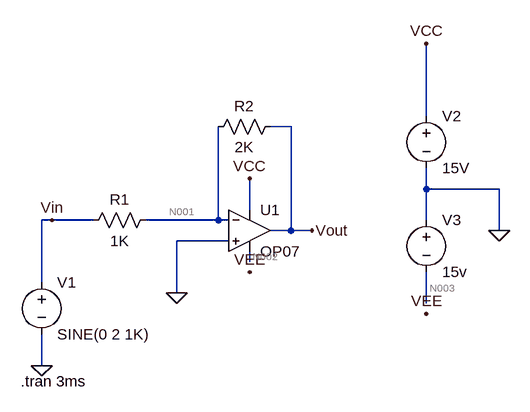
[diagram p0: schematic Draft5.asc]
Draft5.asc, the LTspice schematic file:
Version 4
SHEET 1 880 680
WIRE 464 176 464 64
WIRE 256 192 224 192
WIRE 464 288 464 256
WIRE 576 288 464 288
WIRE 192 320 192 272
WIRE -112 336 -128 336
WIRE -48 336 -112 336
WIRE 144 336 144 192
WIRE 144 336 32 336
WIRE 160 336 144 336
WIRE 464 336 464 288
WIRE 256 352 256 192
WIRE 256 352 224 352
WIRE 288 352 256 352
WIRE 576 352 576 288
WIRE 160 368 80 368
WIRE 192 400 192 384
WIRE -128 432 -128 336
WIRE 80 448 80 368
WIRE 464 464 464 416
WIRE -128 560 -128 512
FLAG -128 560 0
FLAG 80 448 0
FLAG 576 352 0
FLAG 192 272 VCC
FLAG 464 64 VCC
FLAG 192 416 VEE
FLAG 464 480 VEE
FLAG -112 336 Vin
FLAG 288 352 Vout
SYMBOL OpAmps\\OP07 192 288 R0
SYMATTR InstName U1
SYMBOL res 48 320 R90
WINDOW 0 0 56 VBottom 2
WINDOW 3 32 56 VTop 2
SYMATTR InstName R1
SYMATTR Value 1K
SYMBOL res 240 176 R90
WINDOW 0 0 56 VBottom 2
WINDOW 3 32 56 VTop 2
SYMATTR InstName R2
SYMATTR Value 2K
SYMBOL voltage -128 416 R0
WINDOW 123 0 0 Left 0
WINDOW 39 0 0 Left 0
SYMATTR InstName V1
SYMATTR Value SINE(0 2 1K)
SYMBOL voltage 464 160 R0
WINDOW 123 0 0 Left 0
WINDOW 39 0 0 Left 0
SYMATTR InstName V2
SYMATTR Value 15V
SYMBOL voltage 464 320 R0
WINDOW 123 0 0 Left 0
WINDOW 39 0 0 Left 0
SYMATTR InstName V3
SYMATTR Value 15v
TEXT -160 584 Left 2 !.tran 3ms

The netlist it stands for:
* Draft5.asc
XU1 0 N001 VCC N002 Vout LT1001  ; OP07, pins In+ In- V+ V- OUT
R1 N001 Vin 1K
R2 Vout N001 2K
V1 Vin 0 SINE(0 2 1K)
V2 VCC 0 15V
V3 0 N003 15v
.tran 3ms
.lib LTC.lib
.backanno
.end

* Results of the author's LTspice run, read from the files saved beside the schematic
* Operating Point, zero values left out:
*   V(n001) = 3.698 V
*   V(vcc) = 15 V
*   V(n002) = 15.13 V
*   V(vout) = 14.92 V
*   V(n003) = -15 V
*   I(R1) = 3.698 mA
*   I(R2) = 5.61 mA
*   I(V1) = 3.698 mA
*   I(V2) = -5.61 mA
*   Ix(u1:1) = -1.912 mA
*   Ix(u1:2) = 1.912 mA
*   Ix(u1:3) = 5.61 mA
*   Ix(u1:4) = 1.193 pA
*   Ix(u1:5) = -5.61 mA
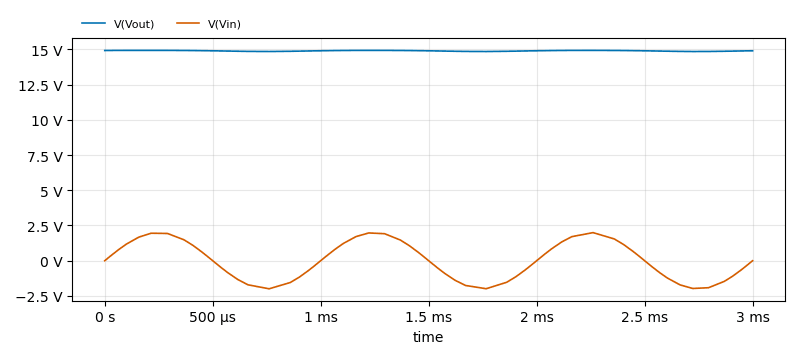
[diagram p1: Transient Analysis of Draft5.asc, plotted from the saved traces]
* Transient Analysis, 1 run:
*   V(Vout): min 14.85 V, max 14.93 V, average 14.89 V, rms 14.89 V, last 14.9 V
*   V(Vin): min -1.993 V, max 1.993 V, average 1.412 mV, rms 1.396 V, last 0 V